# EAGLE design colourSensor (EAGLE 8.5.2)
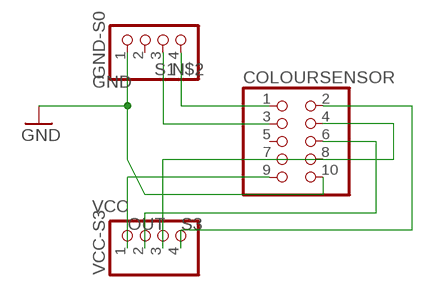
[diagram p0: schematic, sheet 1]

## Parts
COLOURSENSOR  PINHD-2X5  [2X05]
GND-S0  PINHD-1X4  [1X04]
VCC-S3  PINHD-1X4  [1X04]

## Nets
GND: COLOURSENSOR.10 GND-S0.1
N$1: COLOURSENSOR.4 VCC-S3.3
N$2: COLOURSENSOR.1 GND-S0.4
OUT: COLOURSENSOR.6 VCC-S3.2
S1: COLOURSENSOR.3 GND-S0.3
S3: COLOURSENSOR.2 VCC-S3.4
VCC: COLOURSENSOR.9 VCC-S3.1
Unconnected: COLOURSENSOR.5 COLOURSENSOR.7 COLOURSENSOR.8 GND-S0.2

## Library data of the parts
COLOURSENSOR = pinhead:PINHD-2X5: PIN HEADER
GND-S0 VCC-S3 = pinhead:PINHD-1X4: PIN HEADER

## Board
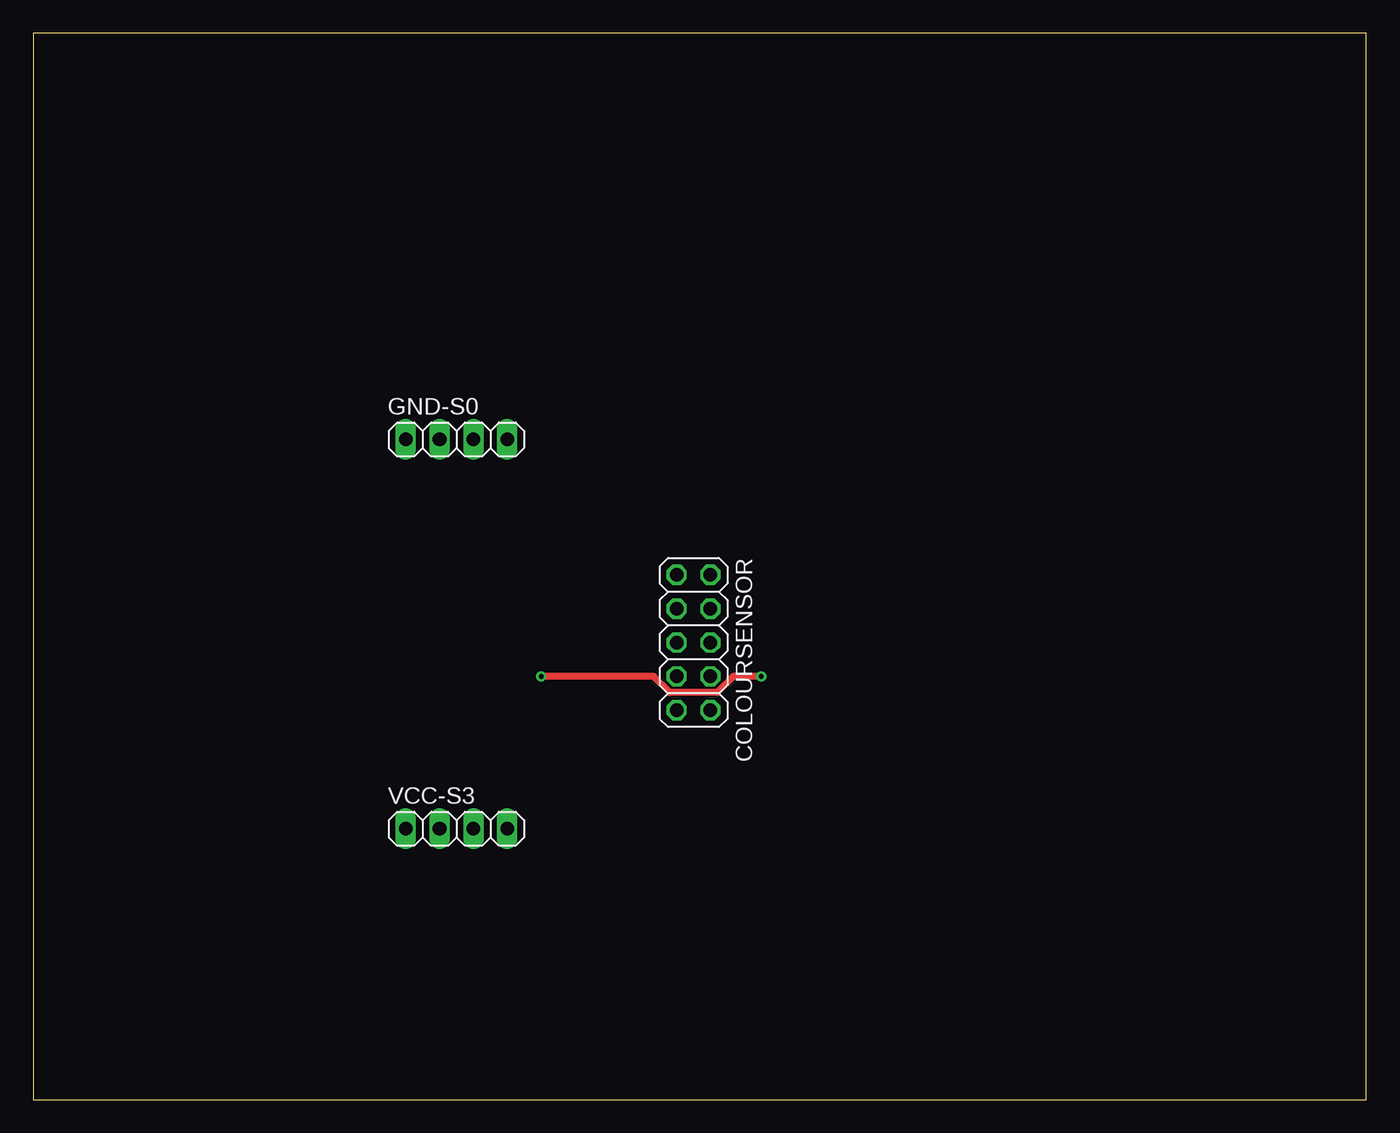
[diagram p1: board, top side]
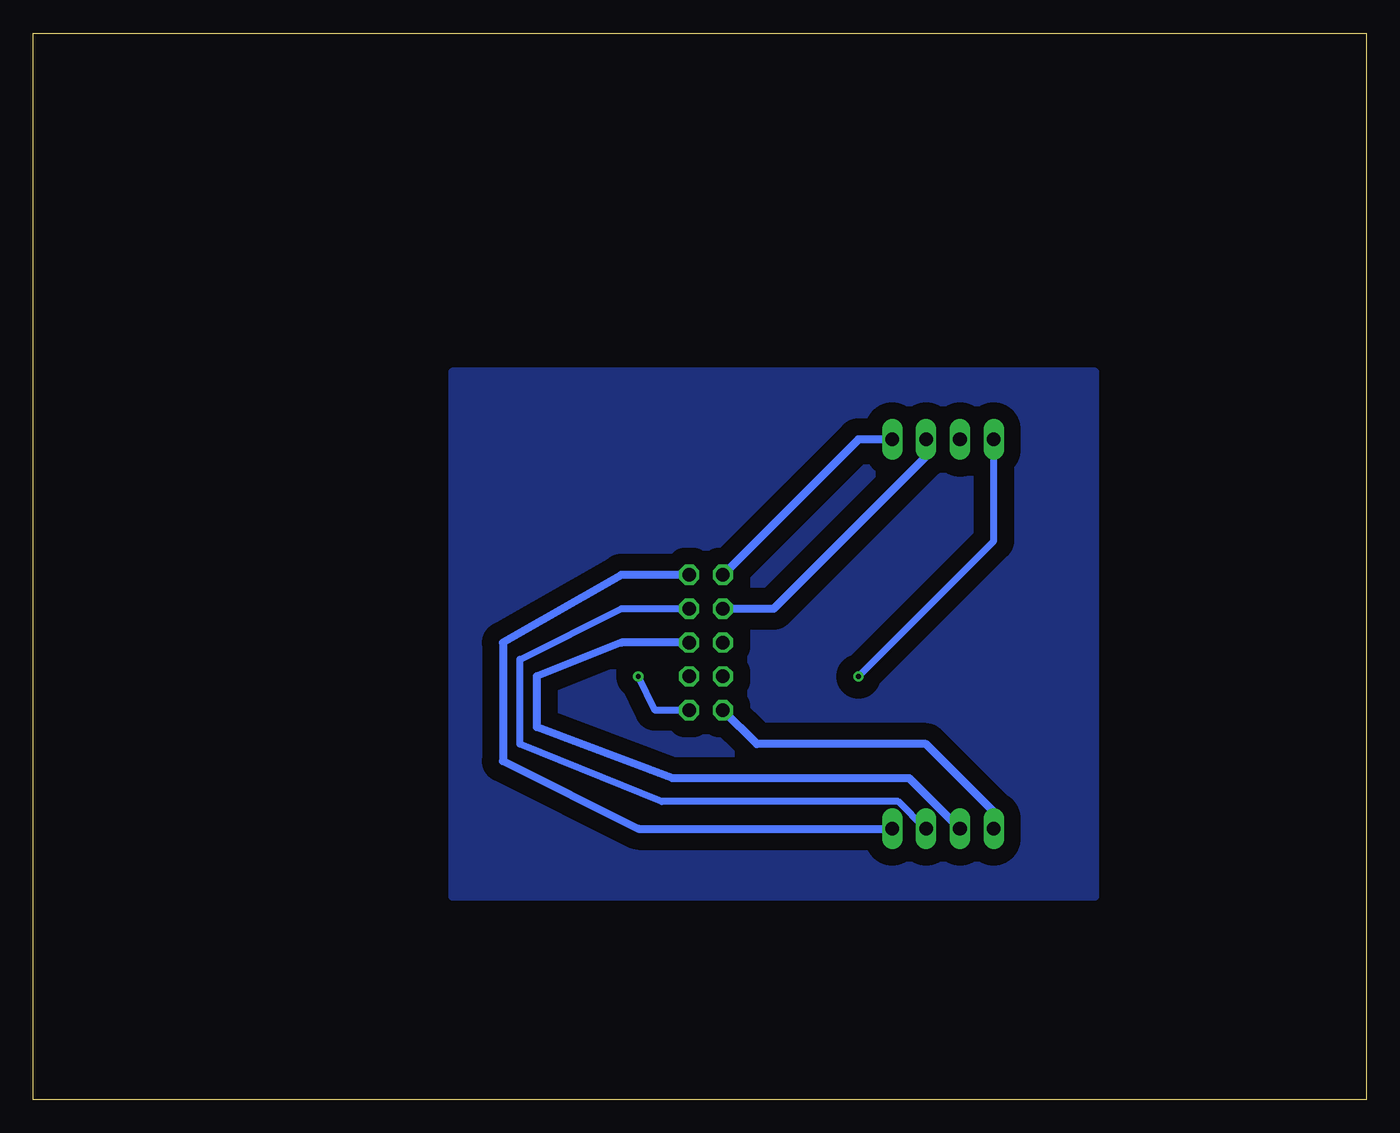
[diagram p2: board, bottom side, seen from below]

Size 100 x 80 mm. Coordinates in mm from the lower left corner, seen from the top.
Outline: 0,0 100,0 100,80 0,80 0,0
Copper layers (1*16): Top 0.035mm / dielectric 1.5mm / Bottom 0.035mm
Design rules "default": minimum track width 10mil, minimum drill 24mil, track to track 8mil, track to pad 8mil, pad to pad 8mil, via to via 8mil, smd to smd 8mil, copper to edge 40mil, drill to drill 8mil, minimum pad ring 10mil, minimum via ring 8mil, stop-mask expansion 4mil, vias tented up to drill 0mil, thermal gap 10mil

### Footprints (pad centres in the part's own frame; a part is rotated, then mirrored left to right if it is on the bottom)
2X05 = drill 1.016 octagon: 1 -5.08,-1.27; 2 -5.08,1.27; 3 -2.54,-1.27; 4 -2.54,1.27; 5 0,-1.27; 6 0,1.27; 7 2.54,-1.27; 8 2.54,1.27; 9 5.08,-1.27; 10 5.08,1.27
1X04 = drill 1.016 long: 1 -3.81,0; 2 -1.27,0; 3 1.27,0; 4 3.81,0

### Placement (x,y rotation side)
COLOURSENSOR  49.53,34.29 270 top
GND-S0  31.75,49.53 0 top
VCC-S3  31.75,20.32 0 top

### Tracks (layer width: path | path; a pad name or v marks a point on that pad's centre or on a via)
GND  (via drill 0.35)
  Top 0.508: v54.61,31.75 52.52,31.75 51.3,30.53 47.76,30.53 46.54,31.75 v38.1,31.75
  Bottom 0.508: COLOURSENSOR.10 53.34,29.21 v54.61,31.75 | v38.1,31.75 27.94,41.91 GND-S0.1
N$1
  Bottom 0.508: VCC-S3.3 33.07,20.32 35.11,22.35 52.83,22.35 63.5,26.67 63.5,33.02 55.88,36.83 COLOURSENSOR.4
N$2
  Bottom 0.61: GND-S0.4 38.1,49.53 COLOURSENSOR.1
N$3
  pour Bottom (isolate 1.27): 20.32,54.61 68.58,54.61 68.58,15.24 20.32,15.24
OUT
  Bottom 0.61: COLOURSENSOR.6 55.88,34.29 62.23,31.75 62.23,27.94 52.07,24.13 34.29,24.13 VCC-S3.2
S1
  Bottom 0.61: COLOURSENSOR.3 44.45,36.83 33.02,48.26 GND-S0.3
S3
  Bottom 0.61: COLOURSENSOR.2 55.88,39.37 64.77,34.29 64.77,25.4 54.61,20.32 VCC-S3.4
VCC
  Bottom 0.61: VCC-S3.1 27.94,21.59 33.02,26.67 45.72,26.67 COLOURSENSOR.9